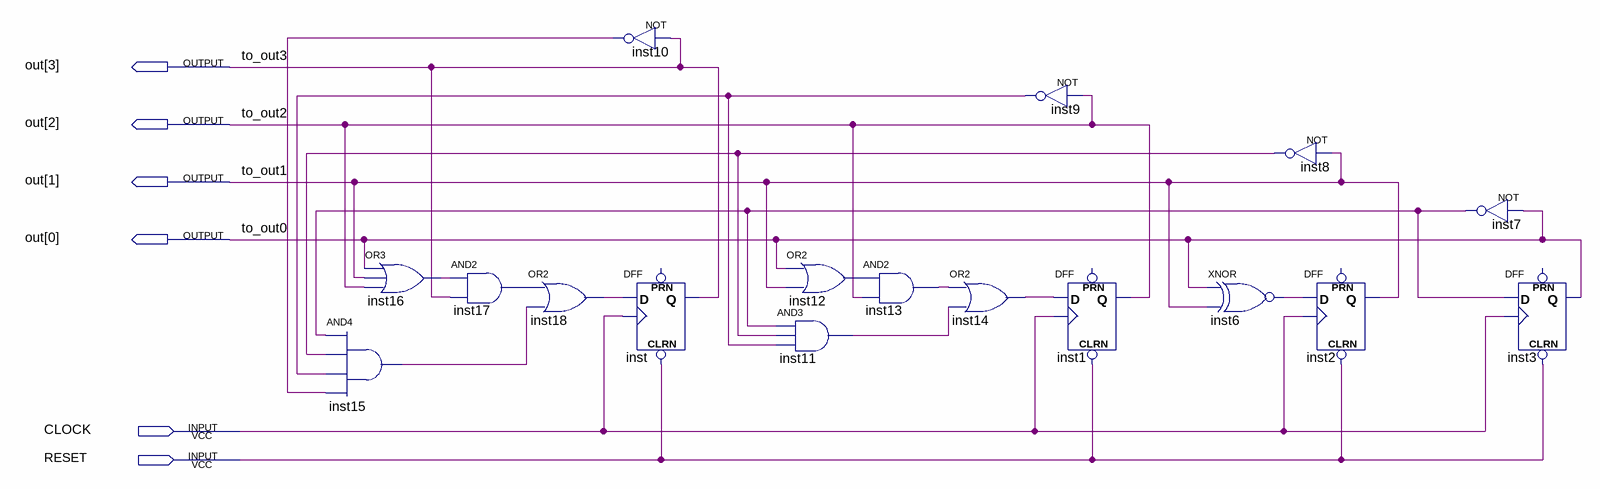
[diagram p0: schematic sheet]
// Quartus schematic count_down_schematic.bdf as structural Verilog: 17 symbols, 6 pins
module count_down_schematic (
  input  CLOCK,
  input  RESET,
  output [3:0] out
);

  wire inst6_out, inst7_out, inst8_out, inst9_out, inst10_out, inst11_out, inst12_out, inst13_out,
       inst14_out, inst15_out, inst16_out, inst17_out, inst18_out;

  and inst15 (inst15_out, inst7_out, inst8_out, inst9_out, inst10_out);
  or inst16 (inst16_out, out[0], out[1], out[2]);
  and inst17 (inst17_out, inst16_out, out[3]);
  or inst18 (inst18_out, inst17_out, inst15_out);
  not inst10 (inst10_out, out[3]);
  DFF inst (.CLRN(RESET), .CLK(CLOCK), .D(inst18_out), .Q(out[3]));  // open: PRN
  or inst12 (inst12_out, out[0], out[1]);
  and inst11 (inst11_out, inst7_out, inst8_out, inst9_out);
  and inst13 (inst13_out, inst12_out, out[2]);
  or inst14 (inst14_out, inst13_out, inst11_out);
  not inst9 (inst9_out, out[2]);
  DFF inst1 (.CLRN(RESET), .CLK(CLOCK), .D(inst14_out), .Q(out[2]));  // open: PRN
  xnor inst6 (inst6_out, out[0], out[1]);
  not inst8 (inst8_out, out[1]);
  DFF inst2 (.CLRN(RESET), .CLK(CLOCK), .D(inst6_out), .Q(out[1]));  // open: PRN
  not inst7 (inst7_out, out[0]);
  DFF inst3 (.CLRN(RESET), .CLK(CLOCK), .D(inst7_out), .Q(out[0]));  // open: PRN

  // Other names for the same wires on the sheet: to_out0 = out[0]; to_out1 = out[1]; to_out2 = out[2];
  //   to_out3 = out[3]
endmodule
